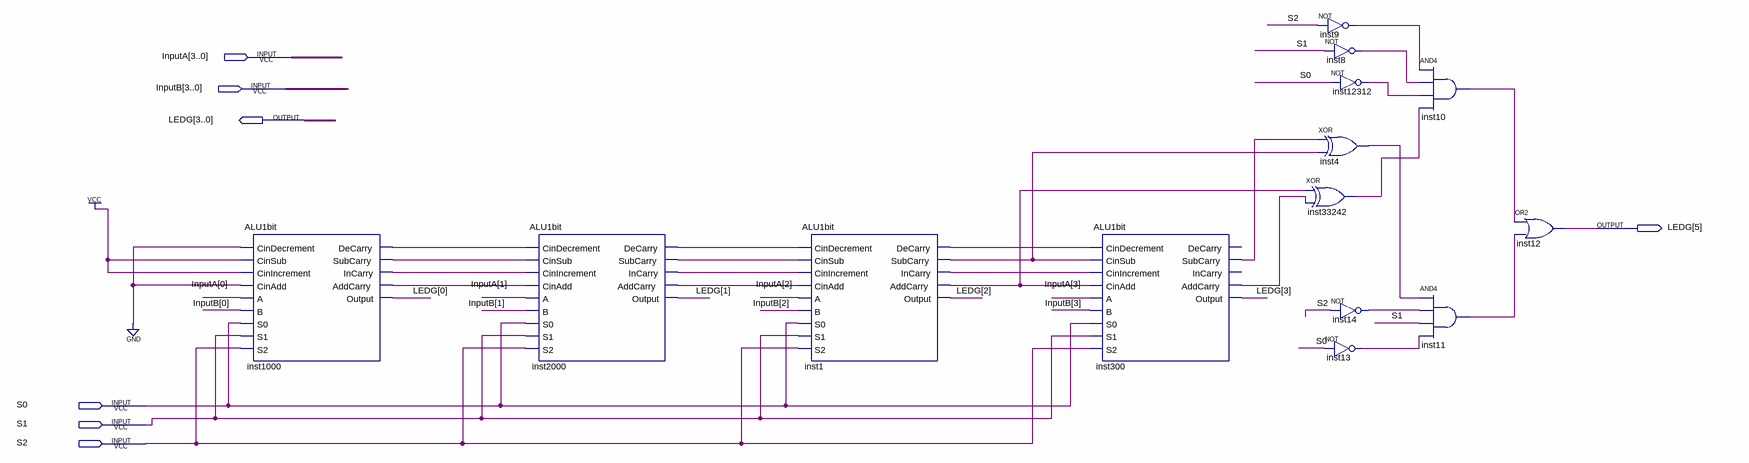
[diagram p0: schematic sheet]
// Quartus schematic ALU4bit.bdf as structural Verilog: 14 symbols, 7 pins
module ALU4bit (
  input  [3:0] InputA,
  input  [3:0] InputB,
  input  S0,
  input  S1,
  input  S2,
  output [5:0] LEDG
);

  wire inst1_addcarry, inst1_decarry, inst1_incarry, inst1_subcarry, inst4_out, inst8_out, inst9_out,
       inst10_out, inst11_out, inst13_out, inst14_out, inst300_addcarry, inst300_subcarry, inst1000_addcarry,
       inst1000_decarry, inst1000_incarry, inst1000_subcarry, inst2000_addcarry, inst2000_decarry,
       inst2000_incarry, inst2000_subcarry, inst12312_out, inst33242_out;

  ALU1bit inst1000 (
    .CinDecrement(1'b0), .CinSub(1'b1), .CinIncrement(1'b1), .CinAdd(1'b0), .A(InputA[0]), .B(InputB[0]),
    .S0(S0), .S1(S1), .S2(S2), .DeCarry(inst1000_decarry), .SubCarry(inst1000_subcarry),
    .InCarry(inst1000_incarry), .AddCarry(inst1000_addcarry), .Output(LEDG[0]));
  ALU1bit inst2000 (
    .CinDecrement(inst1000_decarry), .CinSub(inst1000_subcarry), .CinIncrement(inst1000_incarry),
    .CinAdd(inst1000_addcarry), .A(InputA[1]), .B(InputB[1]), .S0(S0), .S1(S1), .S2(S2),
    .DeCarry(inst2000_decarry), .SubCarry(inst2000_subcarry), .InCarry(inst2000_incarry),
    .AddCarry(inst2000_addcarry), .Output(LEDG[1]));
  ALU1bit inst1 (
    .CinDecrement(inst2000_decarry), .CinSub(inst2000_subcarry), .CinIncrement(inst2000_incarry),
    .CinAdd(inst2000_addcarry), .A(InputA[2]), .B(InputB[2]), .S0(S0), .S1(S1), .S2(S2),
    .DeCarry(inst1_decarry), .SubCarry(inst1_subcarry), .InCarry(inst1_incarry), .AddCarry(inst1_addcarry),
    .Output(LEDG[2]));
  ALU1bit inst300 (
    .CinDecrement(inst1_decarry), .CinSub(inst1_subcarry), .CinIncrement(inst1_incarry),
    .CinAdd(inst1_addcarry), .A(InputA[3]), .B(InputB[3]), .S0(S0), .S1(S1), .S2(S2),
    .SubCarry(inst300_subcarry), .AddCarry(inst300_addcarry), .Output(LEDG[3]));  // open: DeCarry, InCarry
  not inst9 (inst9_out, S2);
  not inst8 (inst8_out, S1);
  not inst12312 (inst12312_out, S0);
  xor inst4 (inst4_out, inst300_subcarry, inst1_subcarry);
  xor inst33242 (inst33242_out, inst1_addcarry, inst300_addcarry);
  not inst14 (inst14_out, S2);
  not inst13 (inst13_out, S0);
  and inst10 (inst10_out, inst9_out, inst8_out, inst12312_out, inst33242_out);
  and inst11 (inst11_out, inst4_out, inst14_out, S1, inst13_out);
  or inst12 (LEDG[5], inst10_out, inst11_out);
endmodule
